# EAGLE schematic pro-one-mcu (EAGLE 5.07)
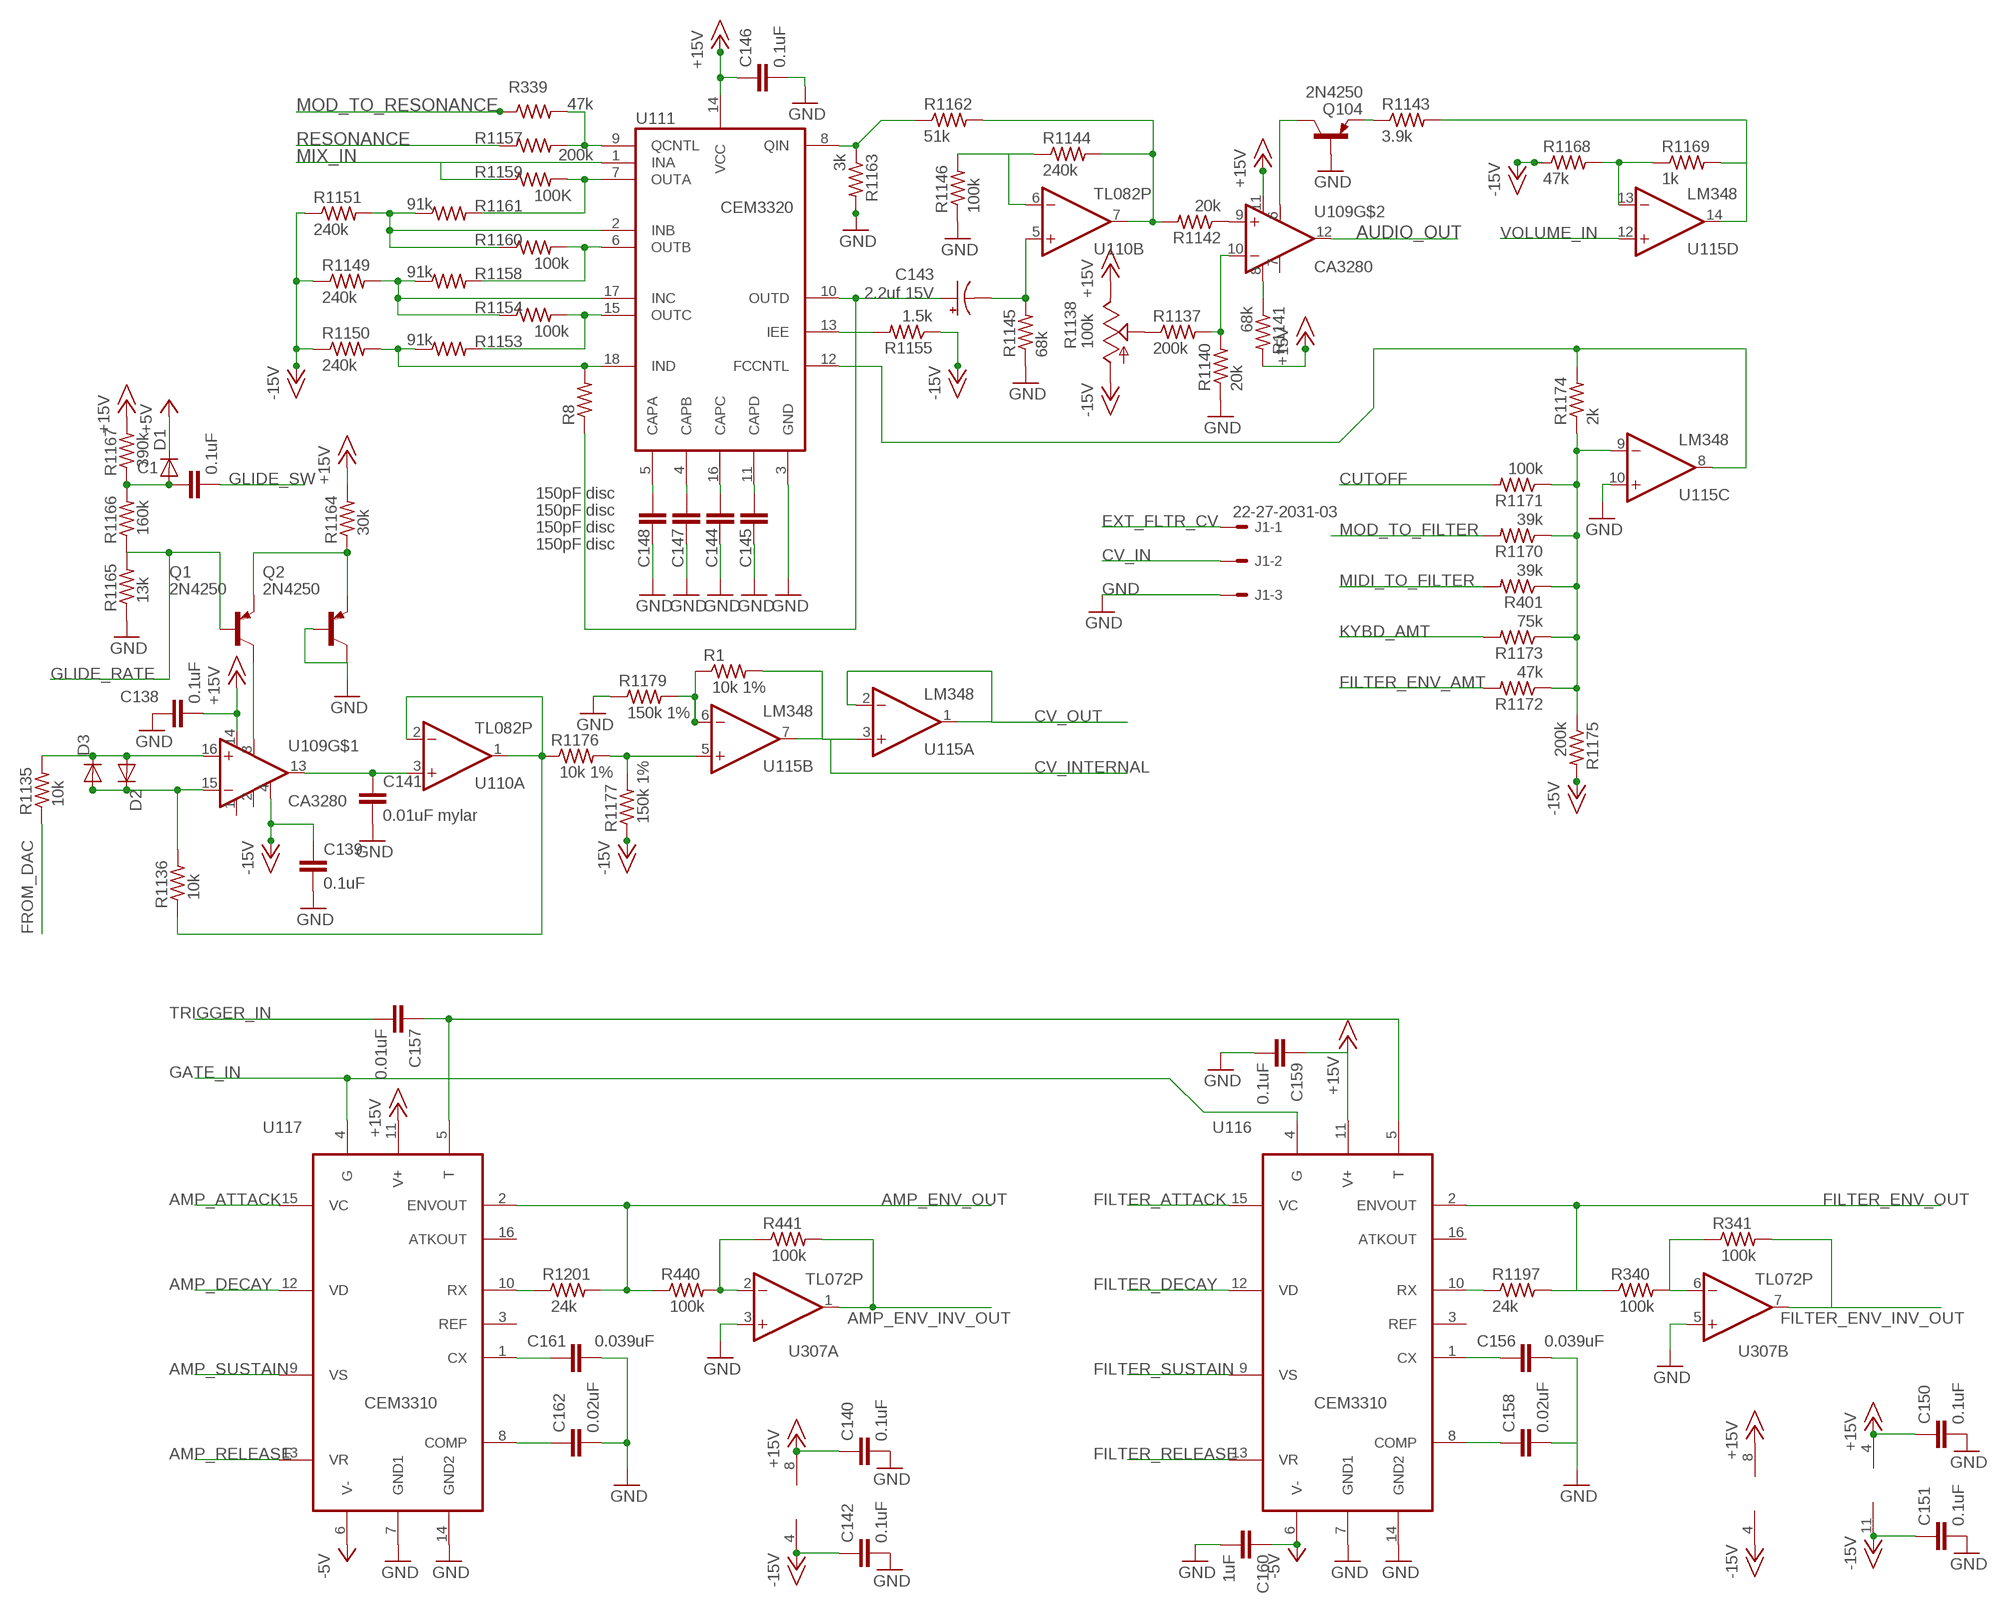
[diagram p0: schematic, sheet 1]

## Parts
C1  0.1uF  C-EU050-025X075  [C050-025X075]
C138  0.1uF  C-EU050-025X075  [C050-025X075]
C139  0.1uF  C-EU050-025X075  [C050-025X075]
C140  0.1uF  C-EU050-025X075  [C050-025X075]
C141  0.01uF mylar  C-EU050-025X075  [C050-025X075]
C142  0.1uF  C-EU050-025X075  [C050-025X075]
C143  2.2uf 15V  CPOL-USE2.5-5  [E2,5-5]
C144  150pF disc  C-EU050-025X075  [C050-025X075]
C145  150pF disc  C-EU050-025X075  [C050-025X075]
C146  0.1uF  C-EU050-025X075  [C050-025X075]
C147  150pF disc  C-EU050-025X075  [C050-025X075]
C148  150pF disc  C-EU050-025X075  [C050-025X075]
C150  0.1uF  C-EU050-025X075  [C050-025X075]
C151  0.1uF  C-EU050-025X075  [C050-025X075]
C156  0.039uF  C-EU050-025X075  [C050-025X075]
C157  0.01uF  C-EU050-025X075  [C050-025X075]
C158  0.02uF  C-EU050-025X075  [C050-025X075]
C159  0.1uF  C-EU050-025X075  [C050-025X075]
C160  1uF  C-EU050-025X075  [C050-025X075]
C161  0.039uF  C-EU050-025X075  [C050-025X075]
C162  0.02uF  C-EU050-025X075  [C050-025X075]
D1  1N4148DO35-7  [DO35-7]
D2  1N4148DO35-7  [DO35-7]
D3  1N4148DO35-7  [DO35-7]
J1  22-27-2031-03  [6410-03]
Q1  2N4250  [TO92]
Q2  2N4250  [TO92]
Q104  2N4250  [TO92]
R1  10k 1%  R-US_0309/10  [0309/10]
R8  R-US_0309/10  [0309/10]
R339  47k  R-US_0309/10  [0309/10]
R340  100k  R-US_0309/10  [0309/10]
R341  100k  R-US_0309/10  [0309/10]
R401  39k  R-US_0309/10  [0309/10]
R440  100k  R-US_0309/10  [0309/10]
R441  100k  R-US_0309/10  [0309/10]
R1135  10k  R-US_0309/10  [0309/10]
R1136  10k  R-US_0309/10  [0309/10]
R1137  200k  R-US_0309/10  [0309/10]
R1138  100k  TRIM_US-PT-10  [PT-10]
R1140  20k  R-US_0309/10  [0309/10]
R1141  68k  R-US_0309/10  [0309/10]
R1142  20k  R-US_0309/10  [0309/10]
R1143  3.9k  R-US_0309/10  [0309/10]
R1144  240k  R-US_0309/10  [0309/10]
R1145  68k  R-US_0309/10  [0309/10]
R1146  100k  R-US_0309/10  [0309/10]
R1149  240k  R-US_0309/10  [0309/10]
R1150  240k  R-US_0309/10  [0309/10]
R1151  240k  R-US_0309/10  [0309/10]
R1153  91k  R-US_0309/10  [0309/10]
R1154  100k  R-US_0309/10  [0309/10]
R1155  1.5k  R-US_0309/10  [0309/10]
R1157  200k  R-US_0309/10  [0309/10]
R1158  91k  R-US_0309/10  [0309/10]
R1159  100K  R-US_0309/10  [0309/10]
R1160  100k  R-US_0309/10  [0309/10]
R1161  91k  R-US_0309/10  [0309/10]
R1162  51k  R-US_0309/10  [0309/10]
R1163  3k  R-US_0309/10  [0309/10]
R1164  30k  R-US_0309/10  [0309/10]
R1165  13k  R-US_0309/10  [0309/10]
R1166  160k  R-US_0309/10  [0309/10]
R1167  390k  R-US_0309/10  [0309/10]
R1168  47k  R-US_0309/10  [0309/10]
R1169  1k  R-US_0309/10  [0309/10]
R1170  39k  R-US_0309/10  [0309/10]
R1171  100k  R-US_0309/10  [0309/10]
R1172  47k  R-US_0309/10  [0309/10]
R1173  75k  R-US_0309/10  [0309/10]
R1174  2k  R-US_0309/10  [0309/10]
R1175  200k  R-US_0309/10  [0309/10]
R1176  10k 1%  R-US_0309/10  [0309/10]
R1177  150k 1%  R-US_0309/10  [0309/10]
R1179  150k 1%  R-US_0309/10  [0309/10]
R1197  24k  R-US_0309/10  [0309/10]
R1201  24k  R-US_0309/10  [0309/10]
U109  CA3280  [DIL16]
U110  TL082P  [DIL08]
U111  CEM3320  [DIL18]
U115  LM348  [DIL14]
U116  CEM3310  [DIL16]
U117  CEM3310  [DIL16]
U307  TL072P  [DIL08]

## Nets
+5V: D1.C
+15V: C138.2 C140.1 C146.1 C150.1 C159.1 R1138.E R1141.2 R1164.2 R1167.2 U109.11(V+) U109.14(V+) U110.8(P:V+) U111.14(VCC) U115.4(P:V+) U116.11(V+) U117.11(V+) U307.8(P:V+)
-5V: C160.1 U116.6(V-) U117.6(V-)
-15V: C139.1 C142.1 C151.1 R1138.A R1149.1 R1150.1 R1151.1 R1155.1 R1168.1 R1175.2 R1177.1 U109.4(V-) U110.4(P:V-) U115.11(P:V-) U307.4(P:V-)
AMP_ATTACK: U117.15(VC)
AMP_DECAY: U117.12(VD)
AMP_ENV_INV_OUT: R441.2 U307.1(A:OUT)
AMP_ENV_OUT: R440.1 R1201.2 U117.2(ENVOUT)
AMP_RELEASE: U117.13(VR)
AMP_SUSTAIN: U117.9(VS)
AUDIO_OUT: U109.12(OUT)
CV_IN: J1.2
CV_INTERNAL: R1.2 U115.3(A:+IN) U115.7(B:OUT)
CV_OUT: U115.1(A:OUT) U115.2(A:-IN)
EXT_FLTR_CV: J1.1
FILTER_ATTACK: U116.15(VC)
FILTER_DECAY: U116.12(VD)
FILTER_ENV_AMT: R1172.2
FILTER_ENV_INV_OUT: R341.2 U307.7(B:OUT)
FILTER_ENV_OUT: R340.1 R1197.2 U116.2(ENVOUT)
FILTER_RELEASE: U116.13(VR)
FILTER_SUSTAIN: U116.9(VS)
FROM_DAC: R1135.1
GATE_IN: U116.4(G) U117.4(G)
GLIDE_RATE: Q1.2(B) R1165.2 R1166.1
GLIDE_SW: C1.2
GND: C138.1 C139.2 C140.2 C141.2 C142.2 C144.2 C145.2 C146.2 C147.2 C148.2 C150.2 C151.2 C156.2 C158.2 C159.2 C160.2 C161.2 C162.2 J1.3 Q2.1(C) Q2.2(B) Q104.2(B) R1140.1 R1145.1 R1146.1 R1163.2 R1165.1 R1179.1 U111.3(GND) U115.10(C:+IN) U116.7(GND1) U116.14(GND2) U117.7(GND1) U117.14(GND2) U307.3(A:+IN) U307.5(B:+IN)
KYBD_AMT: R1173.2
MIDI_TO_FILTER: R401.2
MIX_IN: R1159.1 U111.1(INA)
MOD_TO_FILTER: R1170.2
MOD_TO_RESONANCE: R339.1
N$1: R339.2 R1157.2 U111.9(QCNTL)
N$2: C148.1 U111.5(CAPA)
N$3: R1159.2 R1161.2 U111.7(OUTA)
N$4: R1151.2 R1160.1 R1161.1 U111.2(INB)
N$5: R1158.2 R1160.2 U111.6(OUTB)
N$6: R1149.2 R1154.1 R1158.1 U111.17(INC)
N$7: R1153.2 R1154.2 U111.15(OUTC)
N$8: C147.1 U111.4(CAPB)
N$9: R8.2 R1150.2 R1153.1 U111.18(IND)
N$10: C144.1 U111.16(CAPC)
N$11: C145.1 U111.11(CAPD)
N$12: R1162.1 R1163.1 U111.8(QIN)
N$13: C143.- R1145.2 U110.5(B:+IN)
N$14: R1142.2 R1144.2 R1162.2 U110.7(B:OUT)
N$15: R1144.1 R1146.2 U110.6(B:-IN)
N$16: R1137.2 R1140.2 U109.10(-IN)
N$17: C143.+ R8.1 U111.10(OUTD)
N$18: R1155.2 U111.13(IEE)
N$19: R1142.1 U109.9(+IN)
N$20: R1137.1 R1138.S
N$21: R1141.1 U109.8(ID)
N$22: Q104.1(C) U109.6(IABC)
N$23: Q104.3(E) R1143.1
N$24: C162.1 U117.8(COMP)
N$25: C161.1 U117.1(CX)
N$26: R1168.2 R1169.1 U115.13(D:-IN)
N$27: R1201.1 U117.10(RX)
N$28: R440.2 R441.1 U307.2(A:-IN)
N$29: C157.1 U116.5(T) U117.5(T)
N$30: R340.2 R341.1 U307.6(B:-IN)
N$31: C141.1 U109.13(OUT) U110.3(A:+IN)
N$32: R1197.1 U116.10(RX)
N$33: C156.1 U116.1(CX)
N$34: C158.1 U116.8(COMP)
N$36: R1136.1 R1176.1 U110.1(A:OUT) U110.2(A:-IN)
N$37: R401.1 R1170.1 R1171.1 R1172.1 R1173.1 R1174.1 R1175.1 U115.9(C:-IN)
N$38: R1176.2 R1177.2 U115.5(B:+IN)
N$39: R1174.2 U111.12(FCCNTL) U115.8(C:OUT)
N$40: R1.1 R1179.2 U115.6(B:-IN)
N$41: Q1.1(C) U109.3(IABC)
N$42: D2.A D3.C R1135.2 U109.16(+IN)
N$43: Q1.3(E) Q2.3(E) R1164.1
N$45: C1.1 D1.A R1166.2 R1167.1
N$46: D2.C D3.A R1136.2 U109.15(-IN)
RESONANCE: R1157.1
TRIGGER_IN: C157.2
VOLUME_CTRL: R1143.2 R1169.2 U115.14(D:OUT)
VOLUME_IN: U115.12(D:+IN)
Unconnected: R1171.2 U109.1(ID) U109.2(EMITTER) U109.7(EMITTER) U116.3(REF) U116.16(ATKOUT) U117.3(REF) U117.16(ATKOUT)

## Library data of the parts
C1 C138-C142 C144-C148 C150 C151 C156-C162 = resistor:C-EU: CAPACITOR, European symbol
C143 = rcl:CPOL-US: POLARIZED CAPACITOR, American symbol
D1-D3 = diode:1N4148: DIODE high speed (Philips)
J1 = con-molex:22-?-03: CONNECTOR wire to board 2.54 mm (.1 inch) pitch header
Q1 Q2 Q104 = joakim:2N4250: PNP Transistor
R1 R8 R339-R341 R401 R440 R441 R1135-R1137 R1140-R1146 R1149-R1151 R1153-R1155 R1157-R1177 R1179 R1197 R1201 = resistor:R-US_: RESISTOR, American symbol
R1138 = pot:TRIM_US-: POTENTIOMETER
U109 = joakim:CA3280: Dual opamp
U110 = joakim:TL082: OP AMP
U111 = joakim:CEM3320: Voltage Controlled Filter for musical synthesizers
U115 = joakim:LM348: Quad General Purpose, Low Voltage, Operational Amplifiers
U116 U117 = joakim:CEM3310: Voltage Controlled Oscillator for musical synthesizers
U307 = joakim:TL072: OP AMP